# Altium project GPS.PrjPcb
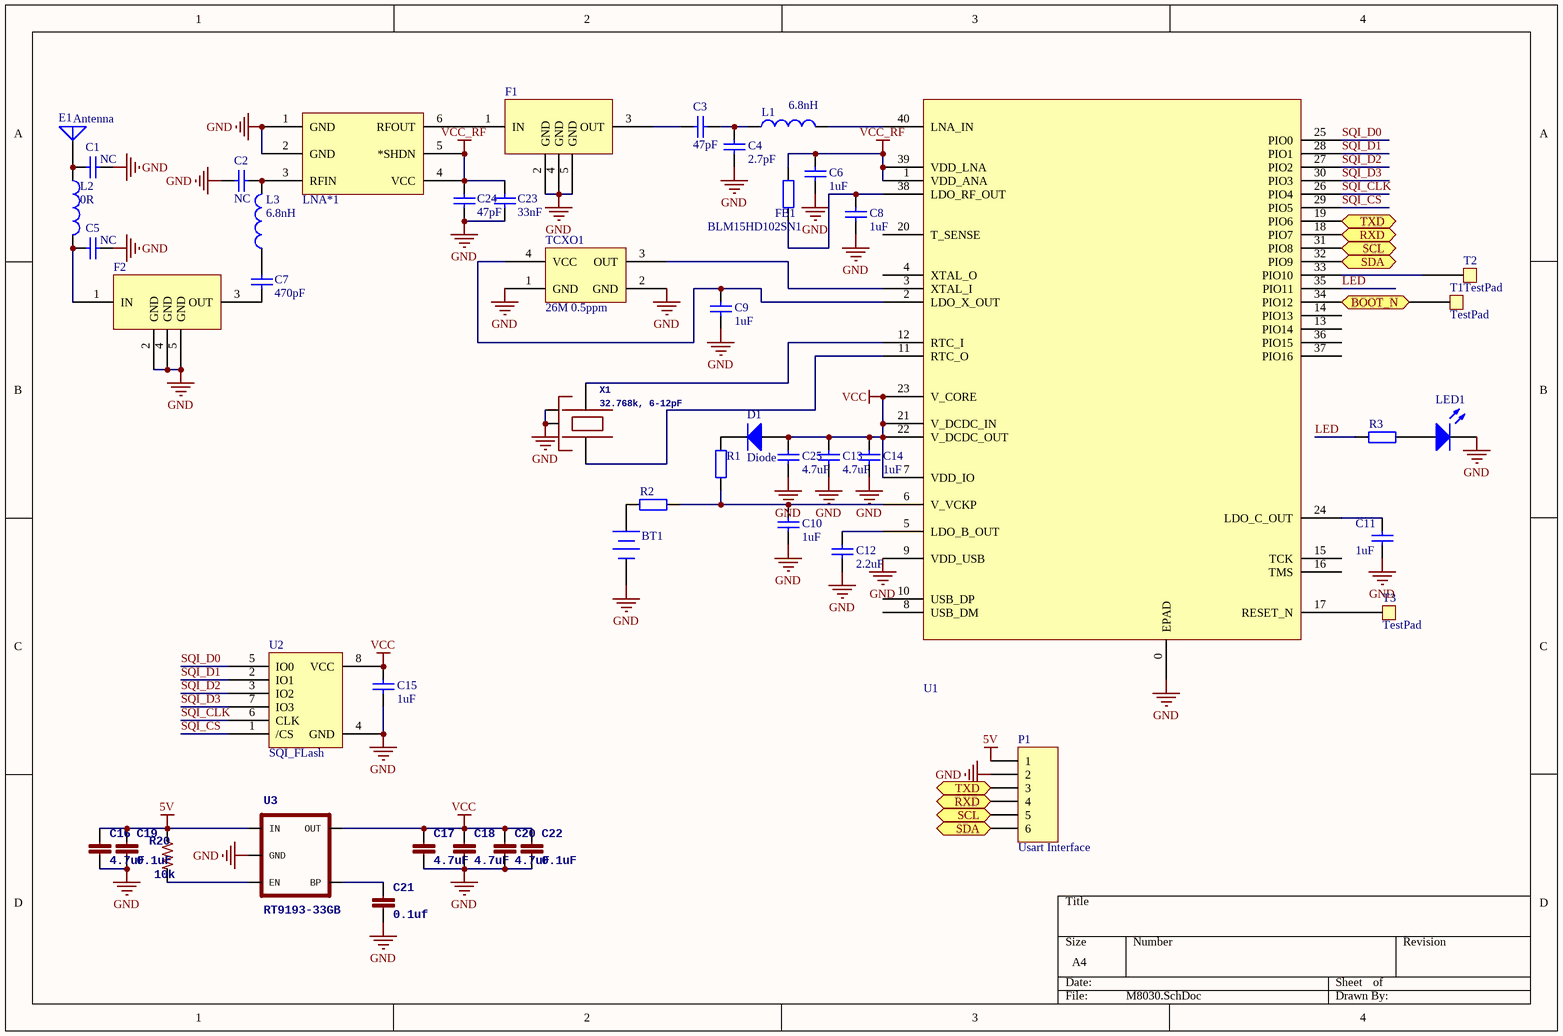
[diagram p0: M8030.SchDoc]
1 sheet, 49 parts. Net scope: flat (ports and power ports of the same name join across sheets).
Board file: M8030.PcbDoc

## Sheet M8030.SchDoc
size A4

### Parts
BT1  Battery  [XH414H-IV01E]  (value not drawn)
C1  NC  [0402]
C2  NC  [0402]
C3  47pF  [0402]
C4  2.7pF  [0402]
C5  NC  [0402]
C6  1uF  [0402]
C7  470pF  [0402]
C8  1uF  [0402]
C9  1uF  [0402]
C10  1uF  [0402]
C11  1uF  [0402]
C12  2.2uF  [0402]
C13  4.7uF  [0402]
C14  1uF  [0402]
C15  1uF  [0402]
C16  4.7uF  [0603]
C17  4.7uF  [0603]
C18  4.7uF  [0603]
C19  0.1uF  [0603]
C20  4.7uF  [0603]
C21  0.1uf  [0402]
C22  0.1uF  [0603]
C23  33nF  [0402]
C24  47pF  [0402]
C25  4.7uF  [0402]
D1  Diode  [LC-SOD-323]
E1  Antenna  [passive25x25 - 3D]
F1  SAW-SAFEB  [SAFEB1G57KE0]  (value not drawn)
F2  SAW-SAFEB  [SAFEB1G57KE0]  (value not drawn)
FB1  BLM15HD102SN1  [0402]
L1  6.8nH  [0402]
L2  0R  [0402]
L3  6.8nH  [0402]
LED1  LED0  [0603]  (value not drawn)
LNA*1  MAX2659  [MAX2659]  (value not drawn)
P1  Usart Interface  [WFRSM125]
R1  (no value)  [0402]
R2  (no value)  [0402]
R3  (no value)  [0402]
R20  10k  [0402]
T1  TestPad  [TestPad - 0.5mm]
T2  TestPad  [TestPad - 0.5mm]
T3  TestPad  [TestPad - 0.5mm]
TCXO1  26M 0.5ppm  [2520_TCXO]
U1  UBX-M8030-KT_1  [UBX-M8030-KT]  (value not drawn)
U2  SQI_FLash  [SO8-208mil]
U3  RT9193-33GB  [SOT23-5]
X1  32.768k, 6-12pF  [MC-146]

### Ports
BOOT_N, RXD, SCL, SDA, TXD

### Nets
5V: C16.1 C19.1 P1.1 R20.1 U3.1(IN)
GND: BT1.2(-) C1.1 C2.2 C4.1 C5.1 C6.1 C8.1 C9.1 C10.1 C11.1 C12.1 C13.1 C14.1 C15.1 C16.2 C17.2 C18.2 C19.2 C20.2 C21.2 C22.2 C23.2 C24.2 C25.1 F1.2(GND) F1.4(GND) F1.5(GND) F2.2(GND) F2.4(GND) F2.5(GND) LED1.2(K) LNA*1.1(GND) LNA*1.2(GND) P1.2 TCXO1.1(GND) TCXO1.2(GND) U1.0(EPAD) U1.9(VDD_USB) U2.4(GND) U3.2(GND) X1.2(NC_2) X1.4(NC_4)
VCC: C13.2 C14.2 C15.2 C17.1 C18.1 C20.1 C22.1 C25.2 D1.1(A) U1.7(VDD_IO) U1.21(V_DCDC_IN) U1.22(V_DCDC_OUT) U1.23(V_CORE) U2.8(VCC) U3.5(OUT)
VCC_RF: C6.2 C23.1 C24.1 FB1.2 LNA*1.4(VCC) LNA*1.5(*SHDN) U1.1(VDD_ANA) U1.39(VDD_LNA)
LED: R3.1 U1.35(PIO11)
SQI_CLK: U1.26(PIO4) U2.6(CLK)
SQI_CS: U1.29(PIO5) U2.1(/CS)
SQI_D0: U1.25(PIO0) U2.5(IO0)
SQI_D1: U1.28(PIO1) U2.2(IO1)
SQI_D2: U1.27(PIO2) U2.3(IO2)
SQI_D3: U1.30(PIO3) U2.7(IO3)
NetBT1_1: BT1.1(+) R2.1
NetC1_2: C1.2 E1.1(A) L2.1
NetC2_1: C2.1 L3.2 LNA*1.3(RFIN)
NetC3_1: C3.1 C4.2 L1.1
NetC3_2: C3.2 F1.3(OUT)
NetC5_2: C5.2 F2.1(IN) L2.2
NetC7_1: C7.1 L3.1
NetC7_2: C7.2 F2.3(OUT)
NetC8_2: C8.2 FB1.1 U1.38(LDO_RF_OUT)
NetC9_2: C9.2 TCXO1.4(VCC) U1.2(LDO_X_OUT)
NetC10_2: C10.2 R1.2 R2.2 U1.6(V_VCKP)
NetC11_2: C11.2 U1.24(LDO_C_OUT)
NetC12_2: C12.2 U1.5(LDO_B_OUT)
NetC21_1: C21.1 U3.4(BP)
NetD1_2: D1.2(K) R1.1
NetF1_1: F1.1(IN) LNA*1.6(RFOUT)
NetL1_2: L1.2 U1.40(LNA_IN)
NetLED1_1: LED1.1(A) R3.2
NetP1_3: P1.3 U1.19(PIO6) ; port TXD
NetP1_4: P1.4 U1.18(PIO7) ; port RXD
NetP1_5: P1.5 U1.31(PIO8) ; port SCL
NetP1_6: P1.6 U1.32(PIO9) ; port SDA
NetR20_2: R20.2 U3.3(EN)
NetT1_1: T1.1 U1.34(PIO12) ; port BOOT_N
NetT2_1: T2.1 U1.33(PIO10)
NetT3_1: T3.1 U1.17(RESET_N)
NetTCXO1_3: TCXO1.3(OUT) U1.3(XTAL_I)
NetU1_11: U1.11(RTC_O) X1.3
NetU1_12: U1.12(RTC_I) X1.1

Not connected (* = marked no-connect by the designer): U1 4(XTAL_O) 8(USB_DM) 10(USB_DP) 13(PIO14) 14(PIO13) 15(TCK) 16(TMS) 20(T_SENSE) 36(PIO15) 37(PIO16)

### Library data of the parts
BT1 = Battery: Multicell Battery; Published: 24-Mar-1999; LatestRevisionDate: 17-Jul-2002; LatestRevisionNote: Re-released for DXP Platform.; PackageReference: BAT-2; Publisher: Altium Limited; PackageDescription: Battery; 2 Leads
C1-C15 C23-C25 = Cap: Capacitor; Published: 8-Jun-2000; LatestRevisionDate: 17-Jul-2002; LatestRevisionNote: Re-released for DXP Platform.; PackageReference: RAD-0.3; Publisher: Altium Limited; PackageDescription: Radial Cap, Thru-Hole; 2 Leads; 0.3 in Pin Spacing
C16-C22 = CAP0402-CAP: 电容; PARTNO: CC0402ZRY5V7BB104
D1 = Diode: Default Diode; Published: 8-Jun-2000; LatestRevisionDate: 17-Jul-2002; LatestRevisionNote: Re-released for DXP Platform.; PackageVersion: Sep-1996; PackageReference: SMC; Publisher: Altium Limited; PackageDescription: DO-214-AB/SMC; 2 C-Bend Leads; Body 7.9 x 5.9 mm, inc. leads (LxW); Code_JEDEC: DO-214-AB
E1 = Antenna: Generic Antenna; Published: 24-Mar-1999; LatestRevisionDate: 17-Jul-2002; LatestRevisionNote: Re-released for DXP Platform.; PackageReference: PIN1; Publisher: Altium Limited
FB1 R1 R2 = Res2: Resistor; Value: 0R; Published: 8-Jun-2000; LatestRevisionDate: 17-Jul-2002; LatestRevisionNote: Re-released for DXP Platform.; PackageReference: AXIAL-0.4; Publisher: Altium Limited; PackageDescription: Axial Device, Thru-Hole; 2 Leads; 0.4 in Pin Spacing
L1-L3 = Inductor: Code_IEC: 1005; Value: 10mH; Published: 8-Jun-2000; LatestRevisionDate: 29-May-2009; LatestRevisionNote: IPC-7351 Footprint Added.; PackageReference: 0402-A; Publisher: Altium Limited; PackageDescription: Chip Inductor; Code_JEITA: 0402
LED1 = LED0: Typical INFRARED GaAs LED; Published: 8-Jun-2000; LatestRevisionDate: 08-Jul-2005; LatestRevisionNote: Mech Layer 1 removed.; PackageReference: LED-0; Publisher: Altium Limited; PackageDescription: LED; 2 Leads
P1 = Header 6: Header, 6-Pin; LatestRevisionDate: 17-Jul-2002; LatestRevisionNote: Re-released for DXP Platform.; Publisher: Altium Limited
R3 = Res2: Resistor; Value: 300R; Published: 8-Jun-2000; LatestRevisionDate: 17-Jul-2002; LatestRevisionNote: Re-released for DXP Platform.; PackageReference: AXIAL-0.4; Publisher: Altium Limited; PackageDescription: Axial Device, Thru-Hole; 2 Leads; 0.4 in Pin Spacing
R20 = RESISTOR0402-RES: 电阻
TCXO1 = 7L26002009(2520TCXO)
U3 = V_REG_LDOSMD: <b>Voltage Regulator LDO</b> / Standard 150mA LDO voltage regulator in SOT-23 layout. Micrel part MIC5205. BP (by-pass) pin is used to lower output noise with 470pF cap.; PARTNO: MIC5207-3.3YM5
X1 = OSCILLATOR-3.2X2.5: Crystal Oscillator in 3.2x2.5 SMD